# EAGLE design midi_transmitter (EAGLE 9.0.1)
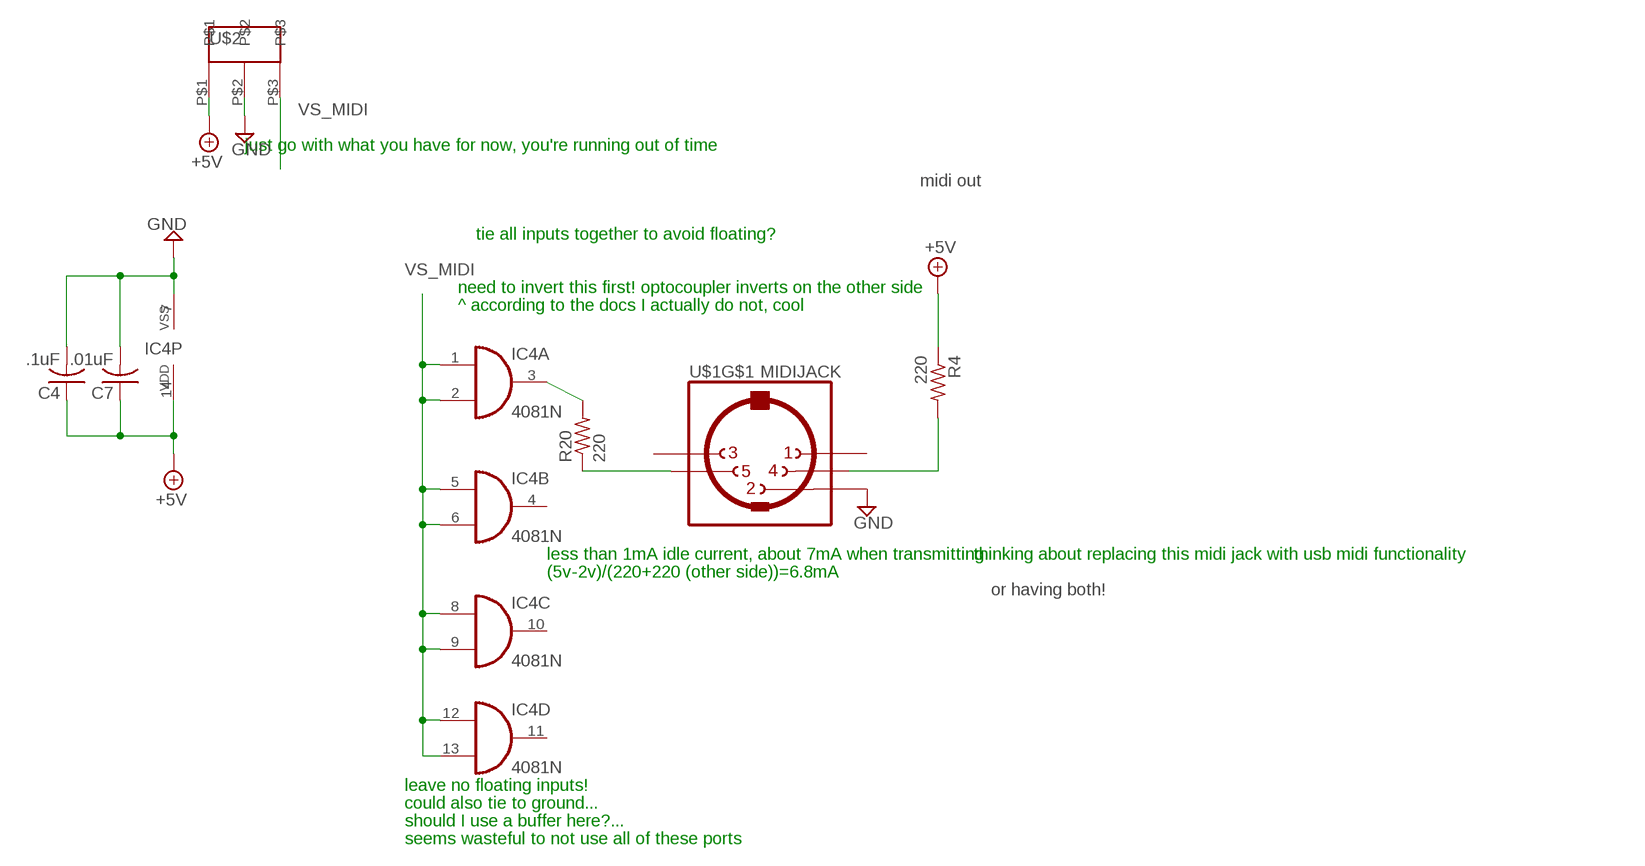
[diagram p0: schematic, sheet 1]

## Parts
C4  .1uF  C-US025-030X050  [C025-030X050]
C7  .01uF  C-US025-030X050  [C025-030X050]
IC4  4081N  [DIL14]
R4  220  R-US_0204/7  [0204/7]
R20  220  R-US_0204/7  [0204/7]
U$1  MIDIJACK  [CP-2350]
U$2  3-PIN-HEADER  [3-PIN-HEADER]

## Nets
+5V: C4.1 C7.1 IC4.14(P:VDD) R4.1 U$2.P$1
GND: C4.2 C7.2 IC4.7(P:VSS) U$1.2 U$2.P$2
N$11: IC4.3(A:O) R20.2
N$45: R4.2 U$1.4
N$46: R20.1 U$1.5
VS_MIDI: IC4.1(A:I0) IC4.2(A:I1) IC4.5(B:I0) IC4.6(B:I1) IC4.8(C:I0) IC4.9(C:I1) IC4.12(D:I0) IC4.13(D:I1) U$2.P$3
Unconnected: IC4.4(B:O) IC4.10(C:O) IC4.11(D:O) U$1.1 U$1.3 U$1.PE1(MT) U$1.PE2(MT) U$1.PE(MT) U$1.PE@(MT)

## Notes on the sheet
- just go with what you have for now, you're running out of time
- midi out
- tie all inputs together to avoid floating?
- need to invert this first! optocoupler inverts on the other side
- ^ according to the docs I actually do not, cool
- less than 1mA idle current, about 7mA when transmitting | thinking about replacing this midi jack with usb midi functionality
- (5v-2v)/(220+220 (other side))=6.8mA
- or having both!
- leave no floating inputs!
- could also tie to ground...
- should I use a buffer here?...
- seems wasteful to not use all of these ports

## Library data of the parts
C4 C7 = rcl:C-US: CAPACITOR, American symbol; SPICEPREFIX: C
IC4 = 40xx:4081: Quad 2-input AND; SPICEPREFIX: J
R4 R20 = rcl:R-US_: RESISTOR, American symbol; SPICEPREFIX: R
U$1 = adafruit:MIDIJACK: DIN 5 jack also known as MIDI jack A modification of conn-hirshman:MAB5SH with two options for the grounding 'teeth'
U$2 = mask_lbr:3-PIN-HEADER

## Net classes
0 default: width 0.61 mm, drill 0.254 mm, clearance 0.254 mm

## Board
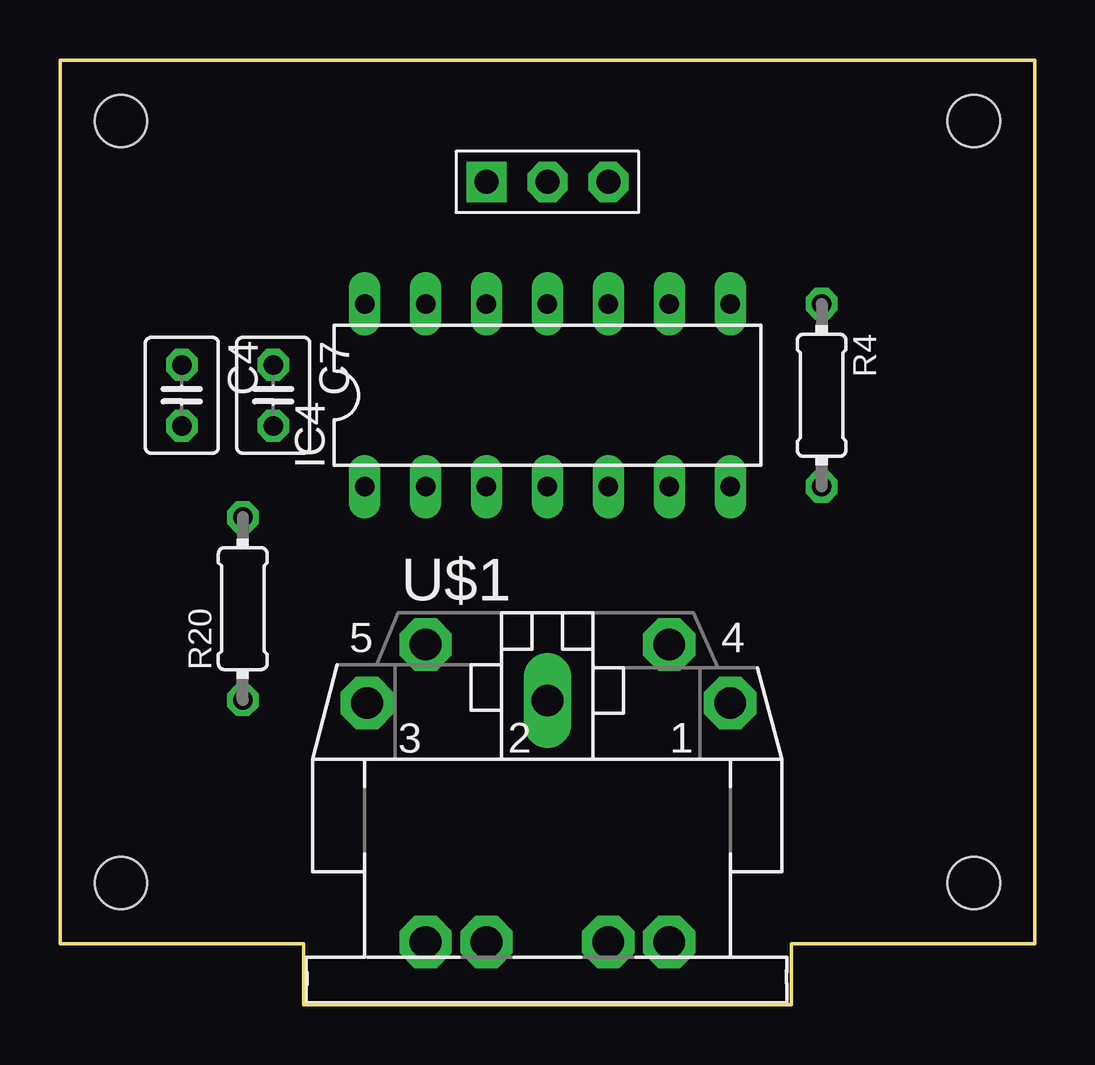
[diagram p1: board, top side]
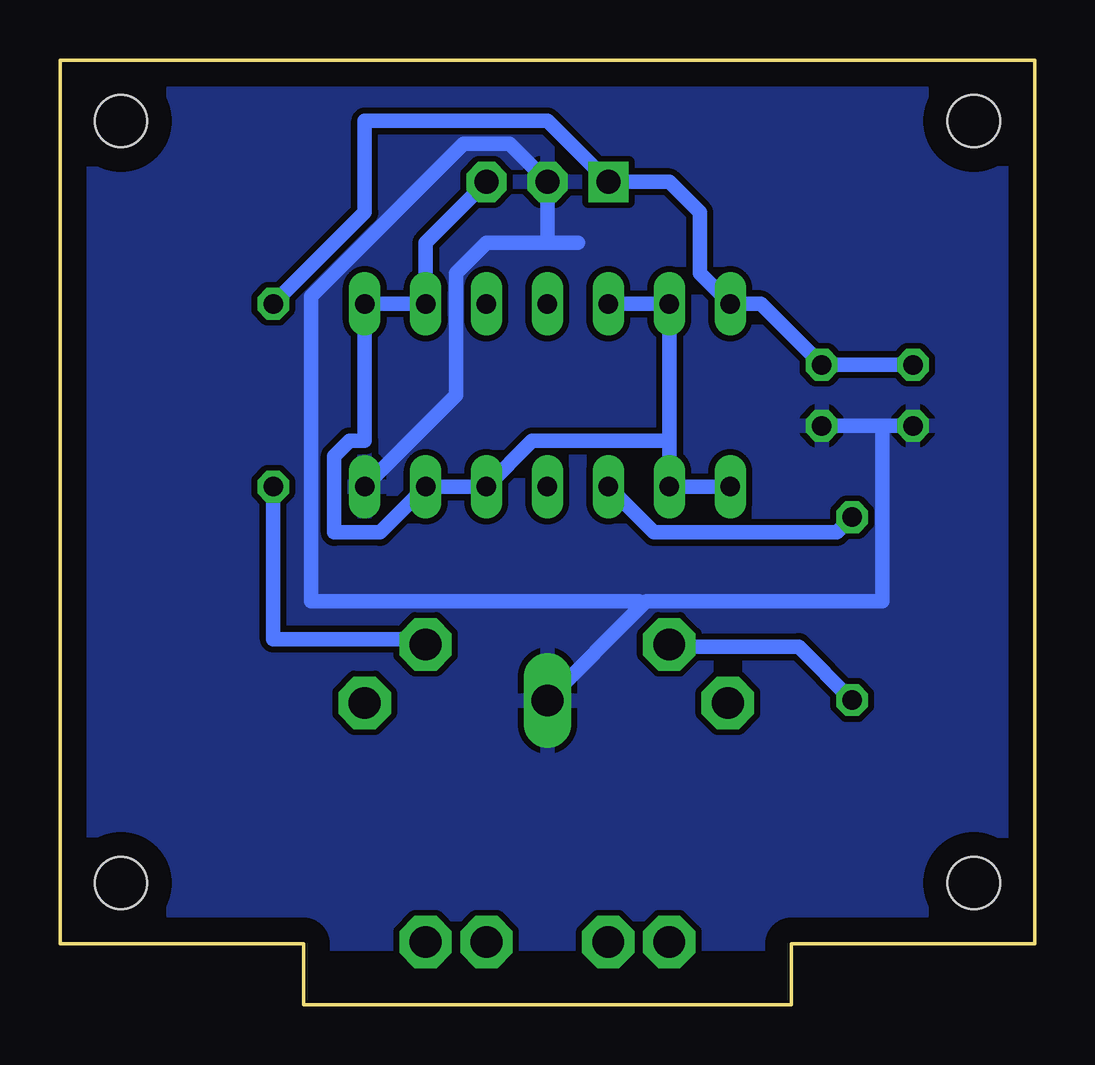
[diagram p2: board, bottom side, seen from below]

Size 40.64 x 39.37 mm. Coordinates in mm from the lower left corner, seen from the top.
Outline: 0,39.37 0,2.54 10.16,2.54 10.16,0 30.48,0 30.48,2.54 40.64,2.54 40.64,39.37 0,39.37
Copper layers (1*16): Top 0.035mm / dielectric 1.5mm / Bottom 0.035mm
Design rules "default": minimum track width 6mil, minimum drill 0.35mm, track to track 6mil, track to pad 6mil, pad to pad 6mil, via to via 6mil, smd to smd 6mil, copper to edge 40mil, drill to drill 6mil, minimum pad ring 10mil, minimum via ring 8mil, stop-mask expansion 4mil, vias tented up to drill 0mil, thermal gap 10mil
Holes 2.18 mm at 2.54,36.83 38.1,36.83 38.1,5.08 2.54,5.08

### Footprints (pad centres in the part's own frame; a part is rotated, then mirrored left to right if it is on the bottom)
C025-030X050 = drill 0.813 octagon: 1 -1.27,0; 2 1.27,0
DIL14 = drill 0.813 long: 1 -7.62,-3.81; 2 -5.08,-3.81; 3 -2.54,-3.81; 4 0,-3.81; 5 2.54,-3.81; 6 5.08,-3.81; 7 7.62,-3.81; 8 7.62,3.81; 9 5.08,3.81; 10 2.54,3.81; 11 0,3.81; 12 -2.54,3.81; 13 -5.08,3.81; 14 -7.62,3.81
0204/7 = drill 0.813 octagon: 1 -3.81,0; 2 3.81,0
CP-2350 = drill 1.321 pad 2.184 octagon: 1 7.62,12.58; 3 -7.52,12.58; 4 5.08,15.02; 5 -5.08,15.02; PE -2.54,2.62; PE1 -5.08,2.62; PE2 5.08,2.62; PE@ 2.54,2.62 | drill 1.321 long: 2 0,12.68
3-PIN-HEADER = drill 1 pad 1.676 square: P$1 -2.54,0 | drill 1 pad 1.676 octagon: P$2 0,0; P$3 2.54,0

### Placement (x,y rotation side)
C4  5.08,25.4 270 top
C7  8.89,25.4 270 top
IC4  20.32,25.4 0 top
R4  31.75,25.4 270 top
R20  7.62,16.51 90 top
U$1  20.32,0 0 top
U$2  20.32,34.29 0 top

### Tracks (layer width: path | path; a pad name or v marks a point on that pad's centre or on a via)
+5V
  Bottom 0.61: C4.1 C7.1 11.43,29.21 IC4.14 13.97,30.48 13.97,33.02 15.24,34.29 U$2.P$1 20.32,36.83 27.94,36.83 27.94,33.02 R4.1
GND
  Bottom 0.61: C4.2 6.35,24.13 | 6.35,24.13 C7.2 | IC4.7 24.13,25.4 24.13,30.48 22.86,31.75 20.32,31.75 | 20.32,31.75 U$2.P$2 21.91,35.88 23.81,35.88 30.16,29.53 30.16,16.83 16.51,16.83 16.35,16.67 | 20.32,31.75 19.05,31.75 | 6.35,24.13 6.35,16.83 16.19,16.83 16.35,16.67 | 16.35,16.67 20.32,12.7 U$1.2
  pour Bottom: 0,39.37 40.64,39.37 40.64,2.54 0,2.54
N$11
  Bottom 0.61: R20.2 8.25,19.68 15.88,19.68 IC4.3
N$45
  Bottom 0.61: R4.2 31.75,15.24 25.4,15.24 U$1.4
N$46
  Bottom 0.61: R20.1 9.84,14.92 15.24,14.92 U$1.5
VS_MIDI
  Bottom 0.61: U$2.P$3 25.4,31.75 IC4.9 IC4.8 27.94,23.5 28.57,23.5 29.21,22.86 29.21,19.68 27.3,19.68 IC4.6 IC4.5 20.96,23.5 15.24,23.5 | IC4.1 IC4.2 15.24,23.5 | IC4.12 IC4.13 15.24,23.5